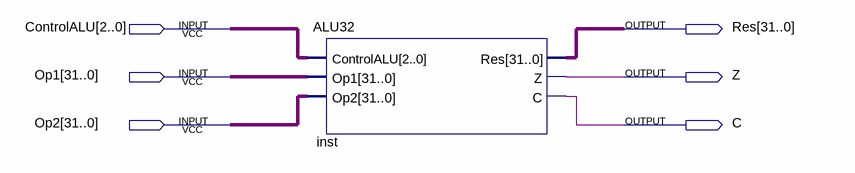
[diagram p0: schematic sheet]
// Quartus schematic ALU.bdf as structural Verilog: 1 symbols, 6 pins
module ALU (
  input  [2:0] ControlALU,
  input  [31:0] Op1,
  input  [31:0] Op2,
  output [31:0] Res,
  output Z,
  output C
);

  ALU32 inst (.ControlALU(ControlALU), .Op1(Op1), .Op2(Op2), .Res(Res), .Z(Z), .C(C));
endmodule
